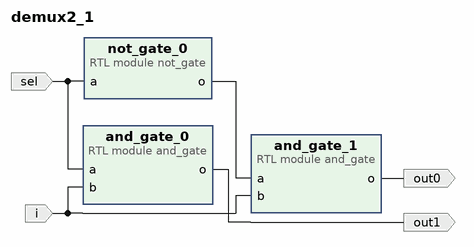
[diagram p0: block diagram of the top level]
# Vivado block design demux2_1, xc7z020clg400-1, Vivado 2023.2
create_bd_design demux2_1

create_bd_port -dir I sel
create_bd_port -dir I i
create_bd_port -dir O out0
create_bd_port -dir O out1

create_bd_cell -type module -reference not_gate not_gate_0
create_bd_cell -type module -reference and_gate and_gate_0
create_bd_cell -type module -reference and_gate and_gate_1

# ---- connections ----

connect_bd_net [get_bd_pins and_gate_0/o] [get_bd_ports out1]
connect_bd_net [get_bd_pins and_gate_1/o] [get_bd_ports out0]
connect_bd_net -net in1_1 [get_bd_ports i] [get_bd_pins and_gate_0/b] [get_bd_pins and_gate_1/b]
connect_bd_net [get_bd_pins not_gate_0/o] [get_bd_pins and_gate_1/a]
connect_bd_net [get_bd_ports sel] [get_bd_pins not_gate_0/a] [get_bd_pins and_gate_0/a]

validate_bd_design
save_bd_design
